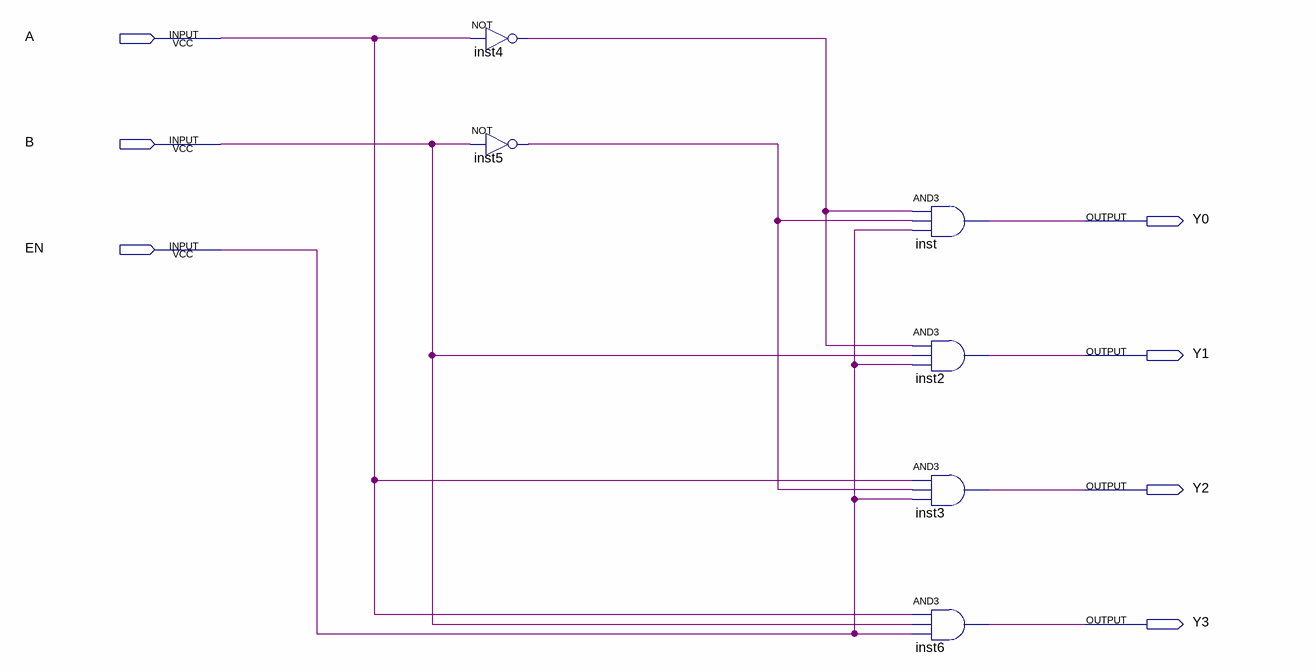
[diagram p0: schematic sheet]
// Quartus schematic DECODER_2_TO_4.bdf as structural Verilog: 6 symbols, 7 pins
module DECODER_2_TO_4 (
  input  A,
  input  B,
  input  EN,
  output Y0,
  output Y1,
  output Y2,
  output Y3
);

  wire inst4_out, inst5_out;

  not inst4 (inst4_out, A);
  not inst5 (inst5_out, B);
  and inst (Y0, inst4_out, inst5_out, EN);
  and inst2 (Y1, inst4_out, B, EN);
  and inst3 (Y2, A, inst5_out, EN);
  and inst6 (Y3, A, B, EN);
endmodule
